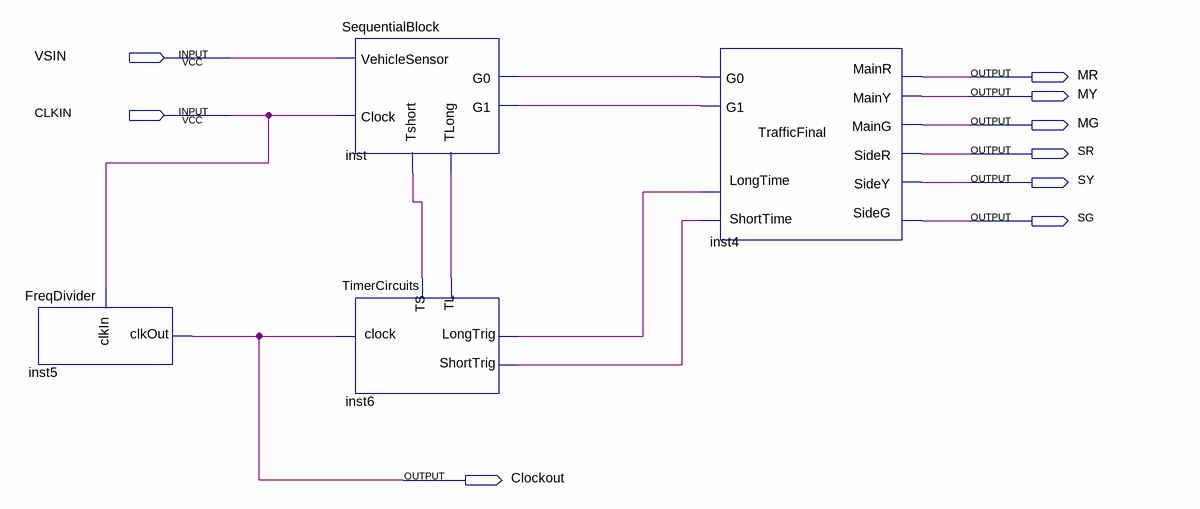
[diagram p0: schematic sheet]
// Quartus schematic TrafficlightsFinal.bdf as structural Verilog: 4 symbols, 9 pins
module TrafficlightsFinal (
  input  VSIN,
  input  CLKIN,
  output MR,
  output MY,
  output MG,
  output SR,
  output SY,
  output SG,
  output Clockout
);

  wire inst4_longtime, inst4_shorttime, inst6_tl, inst6_ts, inst_g0, inst_g1;

  FreqDivider inst5 (.clkIn(CLKIN), .clkOut(Clockout));
  SequentialBlock inst (
    .Clock(CLKIN), .VehicleSensor(VSIN), .Tshort(inst6_ts), .TLong(inst6_tl), .G0(inst_g0), .G1(inst_g1));
  TimerCircuits inst6 (
    .LongTrig(inst4_longtime), .ShortTrig(inst4_shorttime), .clock(Clockout), .TS(inst6_ts), .TL(inst6_tl));
  TrafficFinal inst4 (
    .G0(inst_g0), .G1(inst_g1), .MainR(MR), .MainY(MY), .MainG(MG), .SideR(SR), .SideY(SY), .SideG(SG),
    .LongTime(inst4_longtime), .ShortTime(inst4_shorttime));
endmodule
